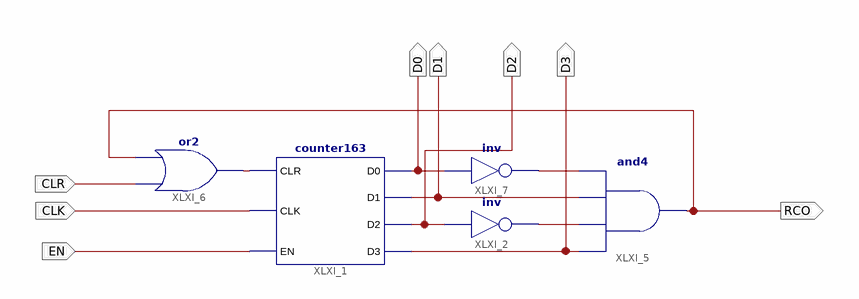
[diagram p0: schematic sheet 1]
// Xilinx ISE schematic mod10.sch (spartan3e) as structural Verilog: 5 symbols, 8 ports
module mod10 (
  input  CLR,
  input  CLK,
  input  EN,
  output D1,
  output D2,
  output D3,
  output RCO,
  output D0
);

  wire XLXN_7, XLXN_12, XLXN_13;

  counter163 XLXI_1 (.CLR(XLXN_7), .CLK(CLK), .EN(EN), .D0(D0), .D1(D1), .D2(D2), .D3(D3));
  not XLXI_2 (XLXN_12, D2);
  and XLXI_5 (RCO, D3, XLXN_12, D1, XLXN_13);
  or XLXI_6 (XLXN_7, CLR, RCO);
  not XLXI_7 (XLXN_13, D0);
endmodule
